# EAGLE design Haptic Schematic (EAGLE 7.7.0)
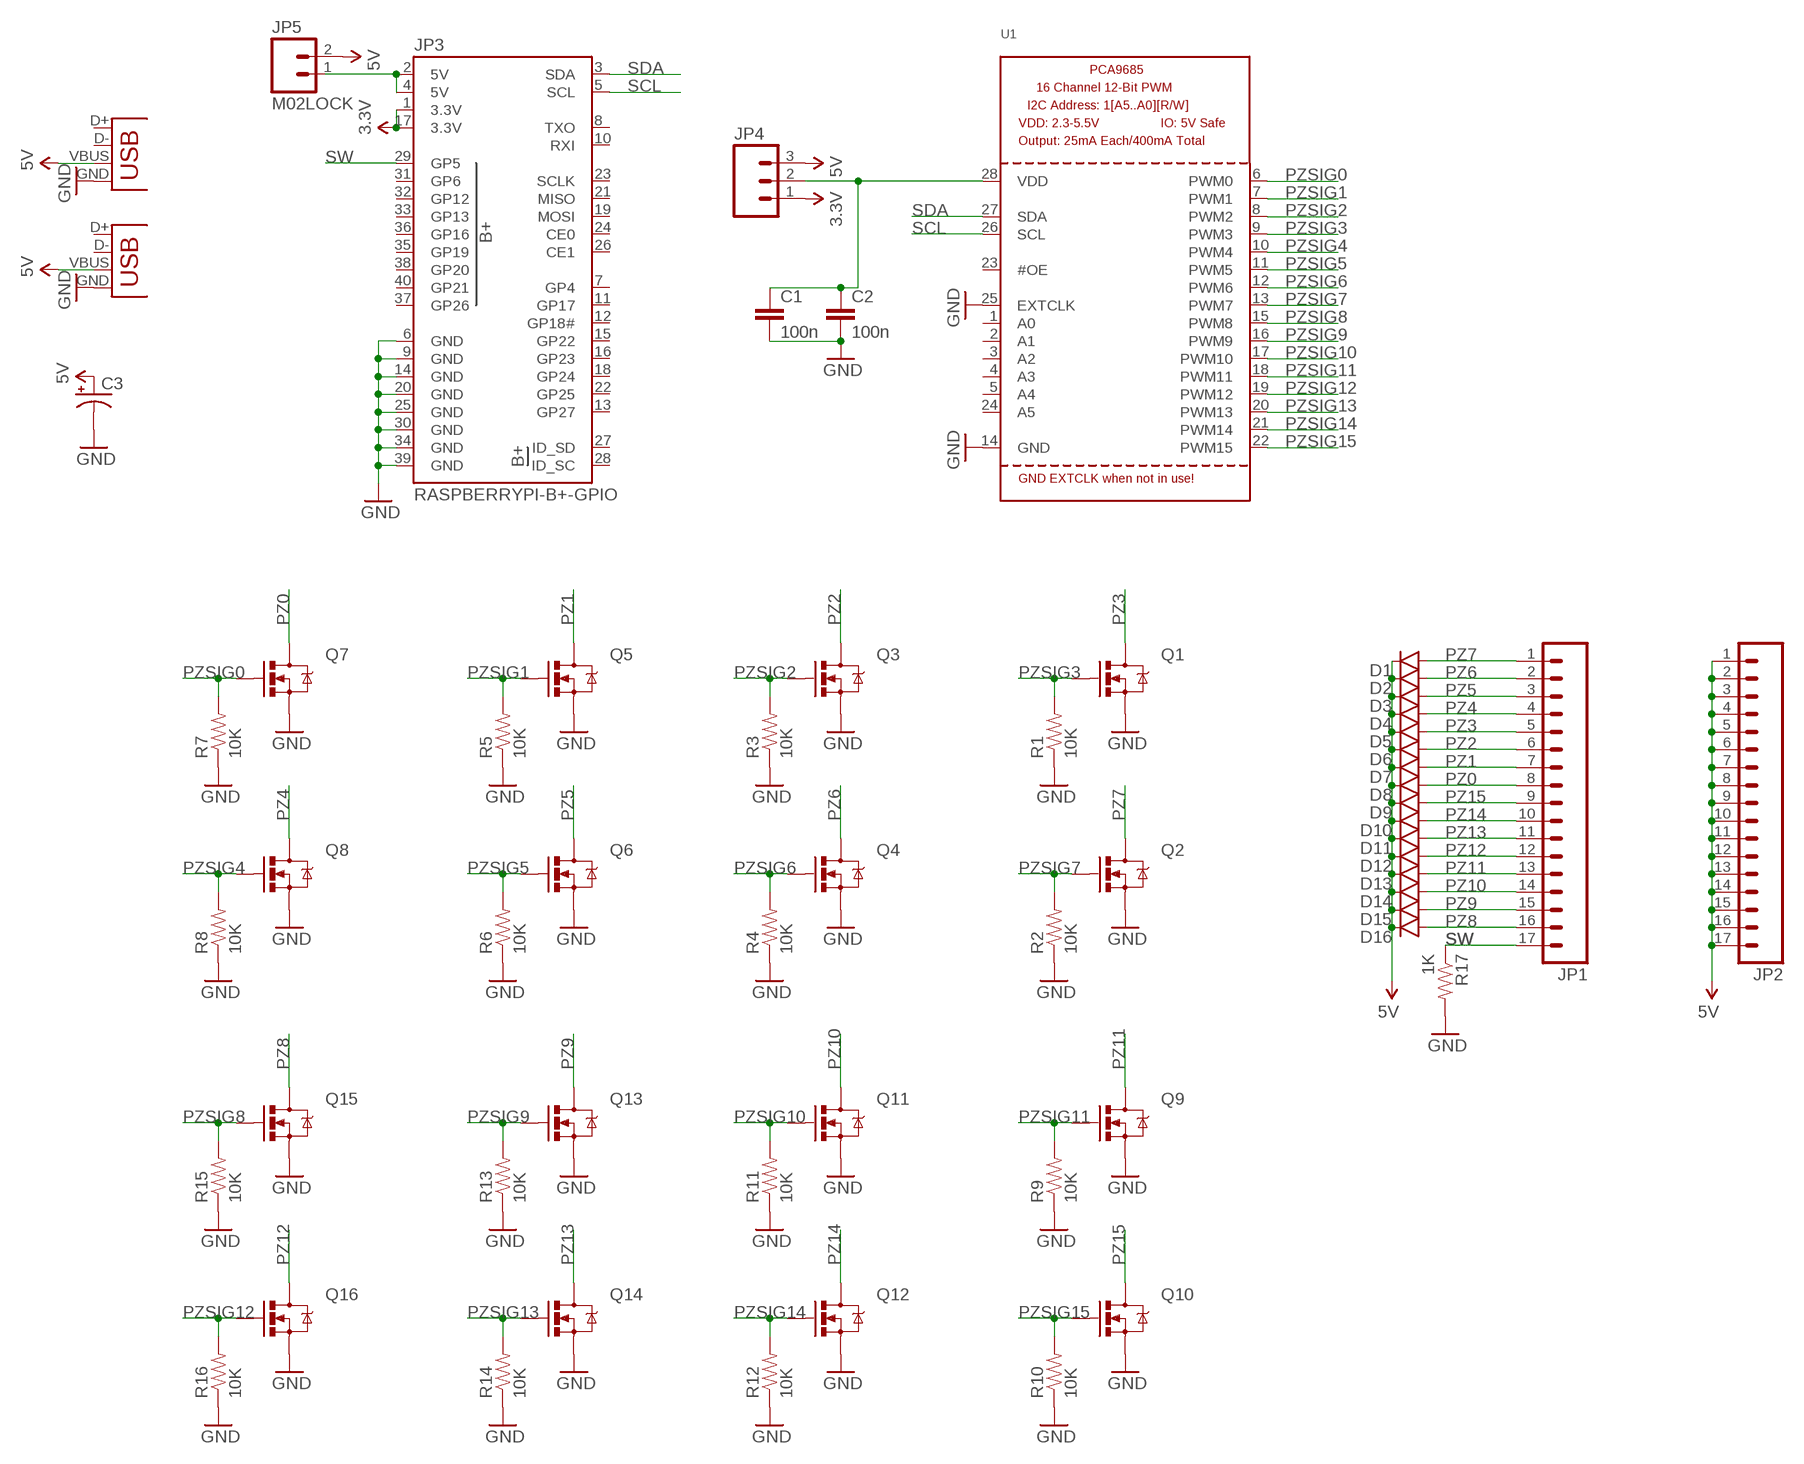
[diagram p0: schematic, sheet 1]

## Parts
C1  100n  CAP0805  [0805]
C2  100n  CAP0805  [0805]
C3  CAP_POLPTH2  [CPOL-RADIAL-10UF-25V]
D1  DIODESOD523  [SOD523]
D2  DIODESOD523  [SOD523]
D3  DIODESOD523  [SOD523]
D4  DIODESOD523  [SOD523]
D5  DIODESOD523  [SOD523]
D6  DIODESOD523  [SOD523]
D7  DIODESOD523  [SOD523]
D8  DIODESOD523  [SOD523]
D9  DIODESOD523  [SOD523]
D10  DIODESOD523  [SOD523]
D11  DIODESOD523  [SOD523]
D12  DIODESOD523  [SOD523]
D13  DIODESOD523  [SOD523]
D14  DIODESOD523  [SOD523]
D15  DIODESOD523  [SOD523]
D16  DIODESOD523  [SOD523]
JP1  M17  [1X17]
JP2  M17  [1X17]
JP3  RASPBERRYPI-B+-GPIO  [2X20-SHROUDED]
JP4  M03LOCK  [1X03_LOCK]
JP5  M02LOCK  [1X02_LOCK]
JP6  USB-B  USBPTH  [USB-B-PTH]
JP7  USB-B  USBPTH  [USB-B-PTH]
Q1  MOSFET-NCHANNEL2N7002PW  [SOT323]
Q2  MOSFET-NCHANNEL2N7002PW  [SOT323]
Q3  MOSFET-NCHANNEL2N7002PW  [SOT323]
Q4  MOSFET-NCHANNEL2N7002PW  [SOT323]
Q5  MOSFET-NCHANNEL2N7002PW  [SOT323]
Q6  MOSFET-NCHANNEL2N7002PW  [SOT323]
Q7  MOSFET-NCHANNEL2N7002PW  [SOT323]
Q8  MOSFET-NCHANNEL2N7002PW  [SOT323]
Q9  MOSFET-NCHANNEL2N7002PW  [SOT323]
Q10  MOSFET-NCHANNEL2N7002PW  [SOT323]
Q11  MOSFET-NCHANNEL2N7002PW  [SOT323]
Q12  MOSFET-NCHANNEL2N7002PW  [SOT323]
Q13  MOSFET-NCHANNEL2N7002PW  [SOT323]
Q14  MOSFET-NCHANNEL2N7002PW  [SOT323]
Q15  MOSFET-NCHANNEL2N7002PW  [SOT323]
Q16  MOSFET-NCHANNEL2N7002PW  [SOT323]
R1  10K  RESISTOR0805-RES  [0805]
R2  10K  RESISTOR0805-RES  [0805]
R3  10K  RESISTOR0805-RES  [0805]
R4  10K  RESISTOR0805-RES  [0805]
R5  10K  RESISTOR0805-RES  [0805]
R6  10K  RESISTOR0805-RES  [0805]
R7  10K  RESISTOR0805-RES  [0805]
R8  10K  RESISTOR0805-RES  [0805]
R9  10K  RESISTOR0805-RES  [0805]
R10  10K  RESISTOR0805-RES  [0805]
R11  10K  RESISTOR0805-RES  [0805]
R12  10K  RESISTOR0805-RES  [0805]
R13  10K  RESISTOR0805-RES  [0805]
R14  10K  RESISTOR0805-RES  [0805]
R15  10K  RESISTOR0805-RES  [0805]
R16  10K  RESISTOR0805-RES  [0805]
R17  1K  RESISTOR0805-RES  [0805]
U1  PCA9685  [TSSOP28]

## Nets
3.3V: JP3.1(3.3V) JP3.17(3.3V) JP4.1
5V: C3.1(+) D1.C D2.C D3.C D4.C D5.C D6.C D7.C D8.C D9.C D10.C D11.C D12.C D13.C D14.C D15.C D16.C JP2.1 JP2.2 JP2.3 JP2.4 JP2.5 JP2.6 JP2.7 JP2.8 JP2.9 JP2.10 JP2.11 JP2.12 JP2.13 JP2.14 JP2.15 JP2.16 JP2.17 JP4.3 JP5.2 JP6.VBUS JP7.VBUS
GND: C1.2 C2.2 C3.2(-) JP3.6(GND) JP3.9(GND) JP3.14(GND) JP3.20(GND) JP3.25(GND) JP3.30(GND) JP3.34(GND) JP3.39(GND) JP6.GND JP7.GND Q1.2(S) Q2.2(S) Q3.2(S) Q4.2(S) Q5.2(S) Q6.2(S) Q7.2(S) Q8.2(S) Q9.2(S) Q10.2(S) Q11.2(S) Q12.2(S) Q13.2(S) Q14.2(S) Q15.2(S) Q16.2(S) R1.1 R2.1 R3.1 R4.1 R5.1 R6.1 R7.1 R8.1 R9.1 R10.1 R11.1 R12.1 R13.1 R14.1 R15.1 R16.1 R17.2 U1.14(GND) U1.25(EXTCLK)
N$2: JP3.2(5V) JP3.4(5V) JP5.1
N$3: C1.1 C2.1 JP4.2 U1.28(VDD)
PZ0: D8.A JP1.8 Q7.3(D)
PZ1: D7.A JP1.7 Q5.3(D)
PZ2: D6.A JP1.6 Q3.3(D)
PZ3: D5.A JP1.5 Q1.3(D)
PZ4: D4.A JP1.4 Q8.3(D)
PZ5: D3.A JP1.3 Q6.3(D)
PZ6: D2.A JP1.2 Q4.3(D)
PZ7: D1.A JP1.1 Q2.3(D)
PZ8: D16.A JP1.16 Q15.3(D)
PZ9: D15.A JP1.15 Q13.3(D)
PZ10: D14.A JP1.14 Q11.3(D)
PZ11: D13.A JP1.13 Q9.3(D)
PZ12: D12.A JP1.12 Q16.3(D)
PZ13: D11.A JP1.11 Q14.3(D)
PZ14: D10.A JP1.10 Q12.3(D)
PZ15: D9.A JP1.9 Q10.3(D)
PZSIG0: Q7.1(G) R7.2 U1.6(PWM0)
PZSIG1: Q5.1(G) R5.2 U1.7(PWM1)
PZSIG2: Q3.1(G) R3.2 U1.8(PWM2)
PZSIG3: Q1.1(G) R1.2 U1.9(PWM3)
PZSIG4: Q8.1(G) R8.2 U1.10(PWM4)
PZSIG5: Q6.1(G) R6.2 U1.11(PWM5)
PZSIG6: Q4.1(G) R4.2 U1.12(PWM6)
PZSIG7: Q2.1(G) R2.2 U1.13(PWM7)
PZSIG8: Q15.1(G) R15.2 U1.15(PWM8)
PZSIG9: Q13.1(G) R13.2 U1.16(PWM9)
PZSIG10: Q11.1(G) R11.2 U1.17(PWM10)
PZSIG11: Q9.1(G) R9.2 U1.18(PWM11)
PZSIG12: Q16.1(G) R16.2 U1.19(PWM12)
PZSIG13: Q14.1(G) R14.2 U1.20(PWM13)
PZSIG14: Q12.1(G) R12.2 U1.21(PWM14)
PZSIG15: Q10.1(G) R10.2 U1.22(PWM15)
SCL: JP3.5(SCL) U1.26(SCL)
SDA: JP3.3(SDA) U1.27(SDA)
SW: JP1.17 JP3.29(GP5) R17.1
Unconnected: JP3.7(GP4) JP3.8(TXO) JP3.10(RXI) JP3.11(GP17) JP3.12(GP18#) JP3.13(GP27) JP3.15(GP22) JP3.16(GP23) JP3.18(GP24) JP3.19(MOSI) JP3.21(MISO) JP3.22(GP25) JP3.23(SCLK) JP3.24(CE0) JP3.26(CE1) JP3.27(ID_SD) JP3.28(ID_SC) JP3.31(GP6) JP3.32(GP12) JP3.33(GP13) JP3.35(GP19) JP3.36(GP16) JP3.37(GP26) JP3.38(GP20) JP3.40(GP21) JP6.D+ JP6.D- JP7.D+ JP7.D- U1.1(A0) U1.2(A1) U1.3(A2) U1.4(A3) U1.5(A4) U1.23(#OE) U1.24(A5)

## Library data of the parts
C1 C2 = SparkFun-Passives:CAP: Capacitor Standard 0603 ceramic capacitor, and 0.1" leaded capacitor.
C3 = SparkFun-Passives:CAP_POL: Capacitor Polarized These are standard SMD and PTH capacitors. Normally 10uF, 47uF, and 100uF in electrolytic and tantalum varieties. Always verify the external diameter of the through hole cap, it varies with capacity, voltage, and manufacturer. The EIA devices should be standard.
D1-D16 = SparkFun-DiscreteSemi:DIODE: Diode These are standard reverse protection diodes and small signal diodes. SMA package can handle up to about 1A. SOD-323 can handle about 200mA. What the SOD-323 package when ordering, there are some mfgs out there that are 5-pin packages.
JP1 JP2 = SparkFun-Connectors:M17: 1x17 .1" header
JP3 = SparkFun-Boards:RASPBERRYPI-B+-GPIO: Raspberry Pi B+ GPIO Header 2x20 pin connector
JP4 = SparkFun-Connectors:M03: Header 3 Standard 3-pin 0.1" header. Use with straight break away headers (SKU : PRT-00116), right angle break away headers (PRT-00553), swiss pins (PRT-00743), machine pins (PRT-00117), and female headers (PRT-00115). Molex polarized connector foot print use with SKU : PRT-08232 with associated crimp pins and housings.
JP5 = SparkFun-Connectors:M02: Standard 2-pin 0.1" header. Use with - straight break away headers ( PRT-00116) - right angle break away headers (PRT-00553) - swiss pins (PRT-00743) - machine pins (PRT-00117) - female headers (PRT-00115) Molex polarized connector foot print use with: PRT-08233 with associated crimp pins and housings. 2.54_SCREWTERM for use with PRT-10571. 3.5mm Screw Terminal footprints for PRT-08084 5mm Screw Terminal footprints for use with PRT-08433
JP6 JP7 = SparkFun-Connectors:USB: USB Connectors USB-B-PTH is fully proven SKU : PRT-00139/CONN-08278 USB-miniB is fully proven SKU : PRT-00587 USB-A-PCB is untested. USB-A-H is throughly reviewed, but untested. Spark Fun Electronics SKU : PRT-00437 USB-B-SMT is throughly reviewed, but untested. Needs silkscreen touching up. USB-A-S has not been used/tested USB-MB-H has not been used/tested USB-MICROB has been used. CONN-09505; PROD_ID: CONN-08278
Q1-Q16 = SparkFun-DiscreteSemi:MOSFET-NCHANNEL: Common NMOSFET Parts MFG P/N Store ID Prod ID FDD8780 TRANS-09984 SI7820DN TRANS-11055 FDS6630A IC-08089 2N7002PW TRANS-11151 FQP30N06L COM-10213 TRANS-10060 BSS123LT1G TRANS-08345 BSS138 TRANS-00830 BS170 2N7000; PROD_ID: TRANS-11151
R1-R17 = SparkFun-Resistors:RESISTOR: Resistor Basic schematic elements and footprints for 0603, 1206, and PTH resistors.
U1 = adafruit:PCA9685: PCA9685 - 16 Channel 12-Bit I2C PWM Controller 5.0V tolerant 16 channel, 12-bit I2C PWM controller with 25mA per output (max. 400mA total) Digikey: 568-5931-1-ND

## Board
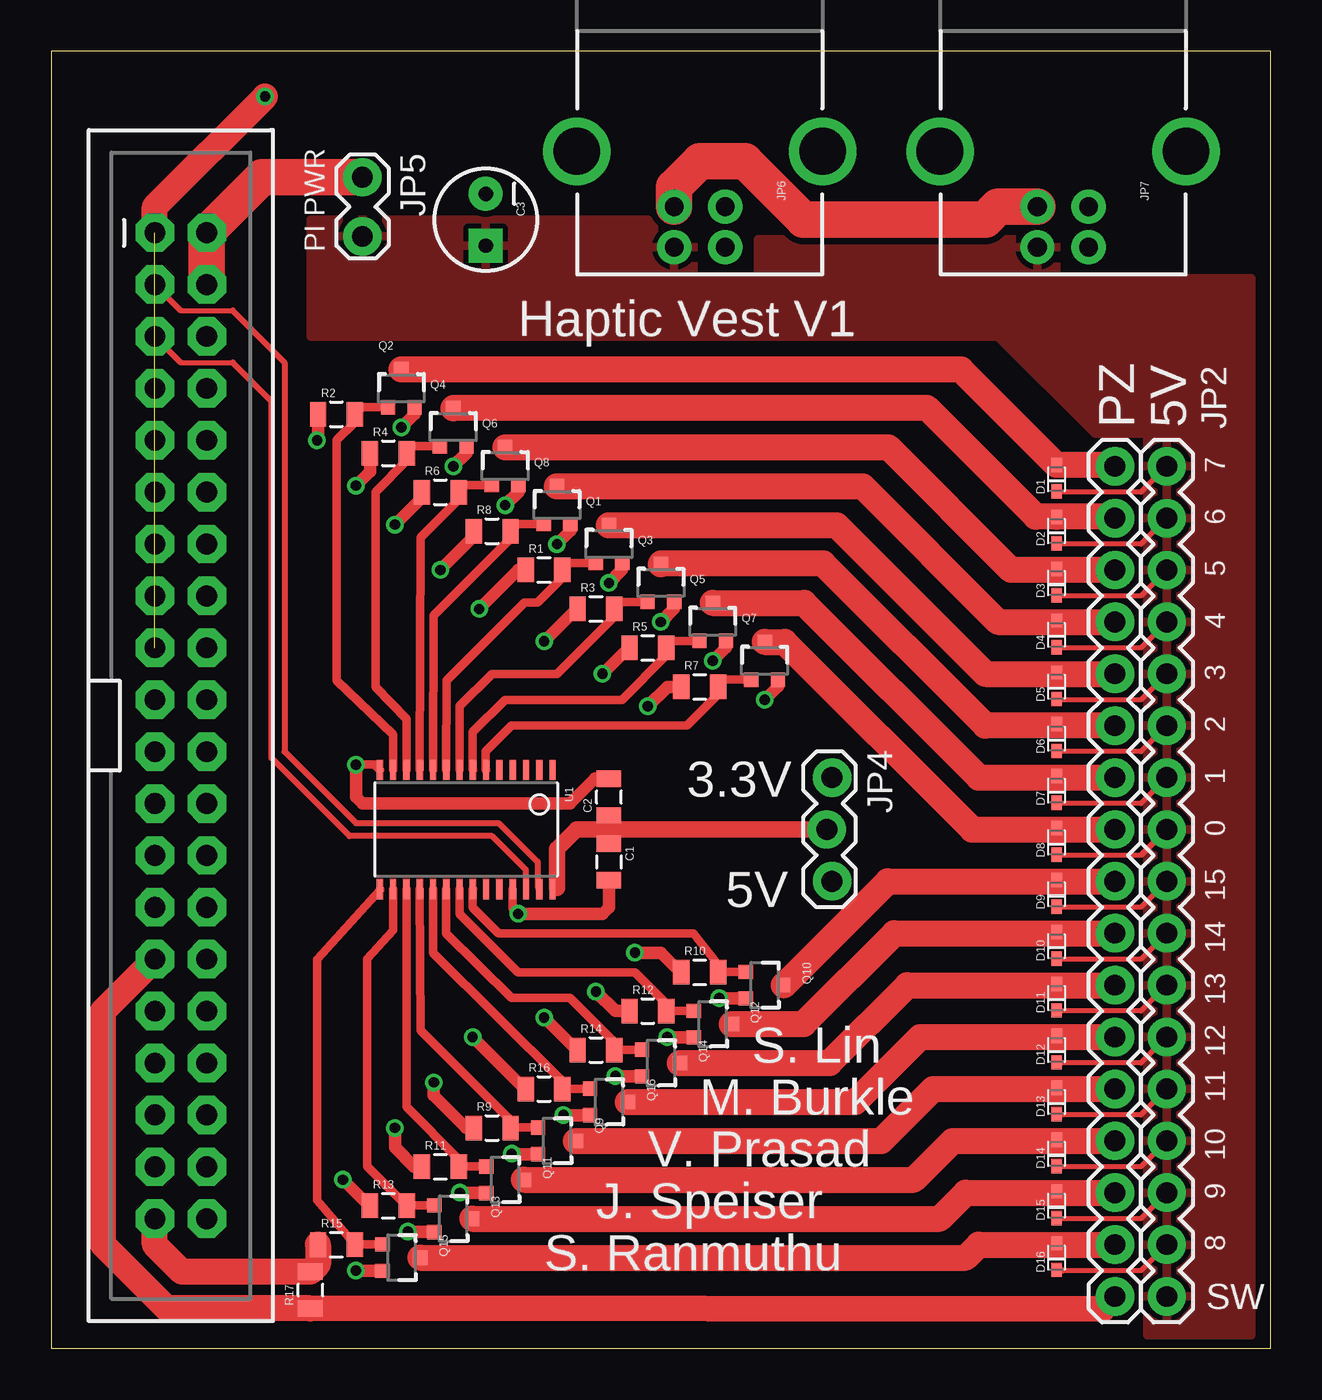
[diagram p1: board, top side]
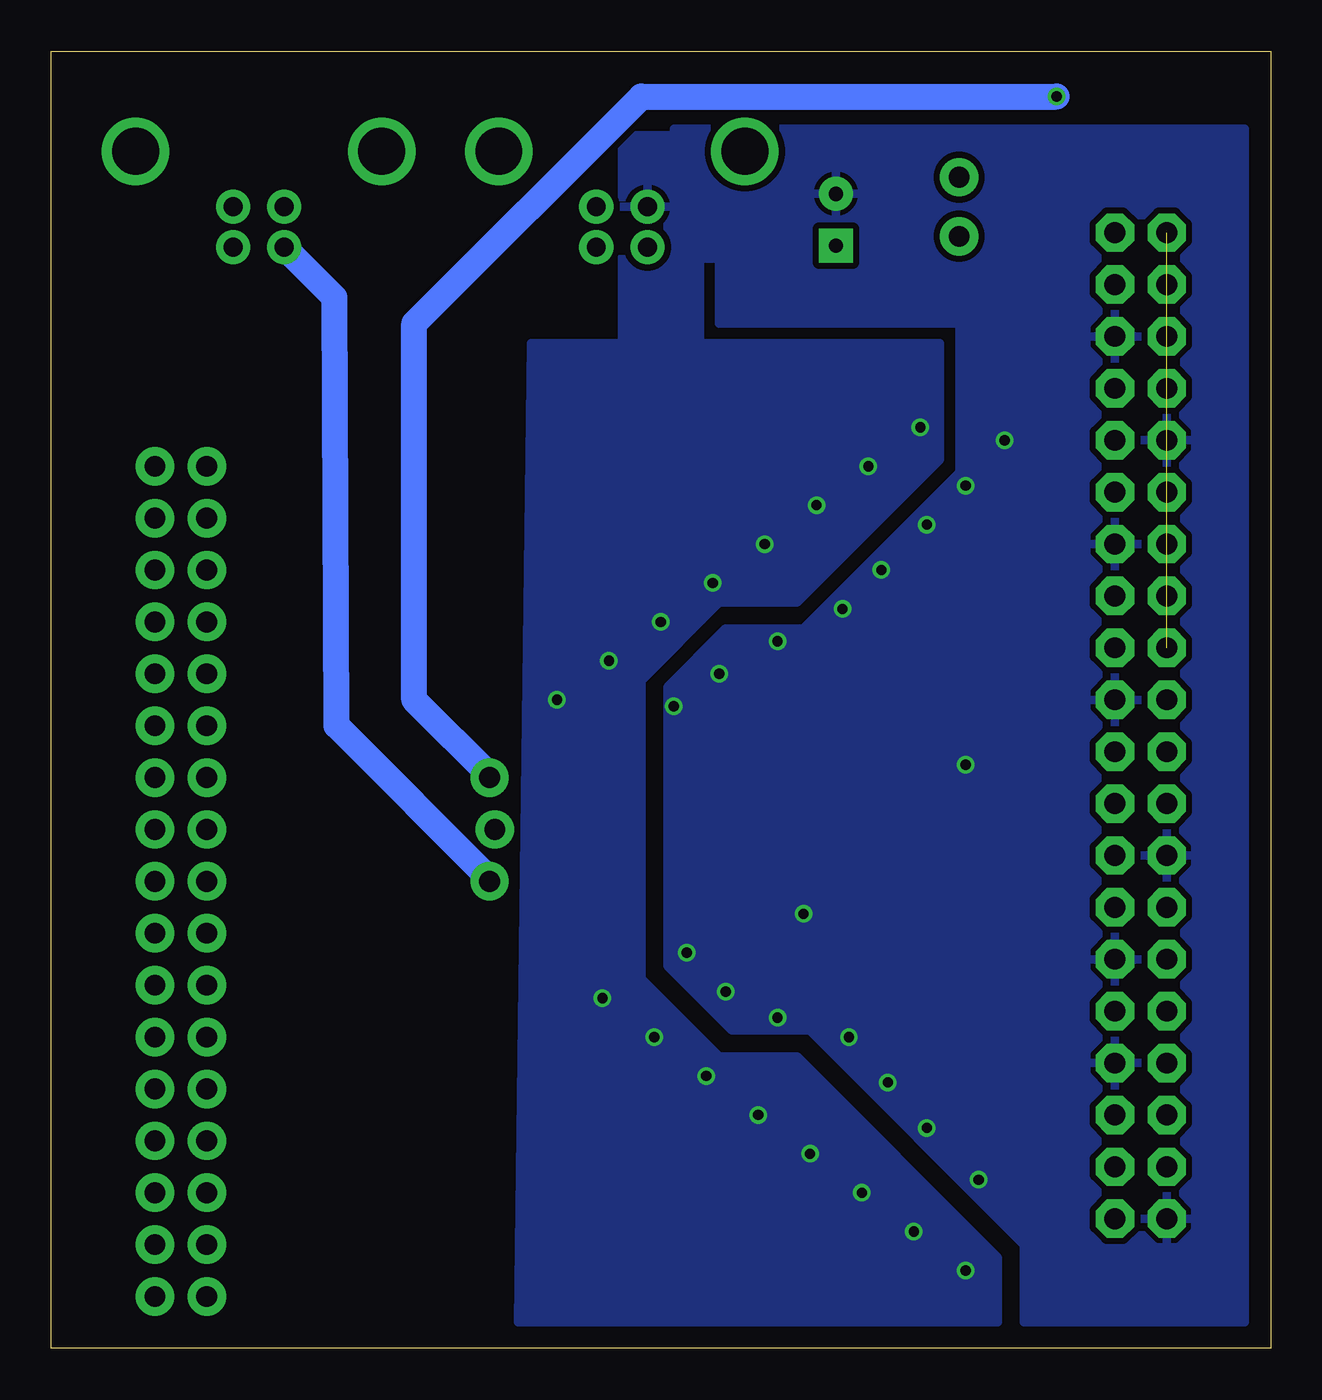
[diagram p2: board, bottom side, seen from below]

Size 59.69 x 63.5 mm. Coordinates in mm from the lower left corner, seen from the top.
Outline: 0,0 59.69,0 59.69,63.5 0,63.5 0,0
Copper layers (1*16): Top 0.0356mm / dielectric 1.5011mm / Bottom 0.0356mm
Design rules "LaenPCBOrder *": minimum track width 6mil, minimum drill 13mil, track to track 6mil, track to pad 6mil, pad to pad 6mil, via to via 6mil, smd to smd 6mil, copper to edge 15mil, drill to drill 6mil, minimum pad ring 7mil, minimum via ring 7mil, stop-mask expansion 3mil, vias tented up to drill 20mil, thermal gap 10mil

### Footprints (pad centres in the part's own frame; a part is rotated, then mirrored left to right if it is on the bottom)
0805 = smd 0.8 x 1.2: 1 -0.9,0; 2 0.9,0
CPOL-RADIAL-10UF-25V = drill 0.7 pad 1.651 square: 1 1.27,0 | drill 0.7 pad 1.651: 2 -1.27,0
SOD523 = smd 0.7 x 0.5: A 0.7,0; C -0.6,0
1X17 = drill 1.016 pad 1.88: 1 0,0; 2 2.54,0; 3 5.08,0; 4 7.62,0; 5 10.16,0; 6 12.7,0; 7 15.24,0; 8 17.78,0; 9 20.32,0; 10 22.86,0; 11 25.4,0; 12 27.94,0; 13 30.48,0; 14 33.02,0; 15 35.56,0; 16 38.1,0; 17 40.64,0
2X20-SHROUDED = drill 1.016 pad 1.88 octagon: 1 -1.27,24.13; 2 1.27,24.13; 3 -1.27,21.59; 4 1.27,21.59; 5 -1.27,19.05; 6 1.27,19.05; 7 -1.27,16.51; 8 1.27,16.51; 9 -1.27,13.97; 10 1.27,13.97; 11 -1.27,11.43; 12 1.27,11.43; 13 -1.27,8.89; 14 1.27,8.89; 15 -1.27,6.35; 16 1.27,6.35; 17 -1.27,3.81; 18 1.27,3.81; 19 -1.27,1.27; 20 1.27,1.27; 21 -1.27,-1.27; 22 1.27,-1.27; 23 -1.27,-3.81; 24 1.27,-3.81; 25 -1.27,-6.35; 26 1.27,-6.35; 27 -1.27,-8.89; 28 1.27,-8.89; 29 -1.27,-11.43; 30 1.27,-11.43; 31 -1.27,-13.97; 32 1.27,-13.97; 33 -1.27,-16.51; 34 1.27,-16.51; 35 -1.27,-19.05; 36 1.27,-19.05; 37 -1.27,-21.59; 38 1.27,-21.59; 39 -1.27,-24.13; 40 1.27,-24.13
1X03_LOCK = drill 1.016 pad 1.88: 1 0,0.127; 2 2.54,-0.127; 3 5.08,0.127
1X02_LOCK = drill 1.016 pad 1.88: 1 -0.178,0; 2 2.718,0
USB-B-PTH = drill 0.914 pad 1.676: D+ 0,1.25; D- 1.981,1.25; GND 0,-1.25; VBUS 1.981,-1.25 | drill 2.286: S1 -2.718,-6.02; S2 -2.718,6.02
SOT323 = smd 0.7 x 0.7: 1 -0.65,-0.925; 2 0.65,-0.925; 3 0,0.925
TSSOP28 = smd 0.305 x 0.991: 1 -4.225,-2.918; 2 -3.575,-2.918; 3 -2.925,-2.918; 4 -2.275,-2.918; 5 -1.625,-2.918; 6 -0.975,-2.918; 7 -0.325,-2.918; 8 0.325,-2.918; 9 0.975,-2.918; 10 1.625,-2.918; 11 2.275,-2.918; 12 2.925,-2.918; 13 3.575,-2.918; 14 4.225,-2.918; 15 4.225,2.918; 16 3.575,2.918; 17 2.925,2.918; 18 2.275,2.918; 19 1.625,2.918; 20 0.975,2.918; 21 0.325,2.918; 22 -0.325,2.918; 23 -0.975,2.918; 24 -1.625,2.918; 25 -2.275,2.918; 26 -2.925,2.918; 27 -3.575,2.918; 28 -4.225,2.918

### Placement (x,y rotation side)
C1  27.3,23.81 270 top
C2  27.3,26.99 90 top
C3  21.27,55.24 270 top
D1  49.21,42.55 90 top
D2  49.21,40.01 90 top
D3  49.21,37.47 90 top
D4  49.21,34.92 90 top
D5  49.21,32.38 90 top
D6  49.21,29.84 90 top
D7  49.21,27.3 90 top
D8  49.21,24.77 90 top
D9  49.21,22.23 90 top
D10  49.21,19.68 90 top
D11  49.21,17.14 90 top
D12  49.21,14.61 90 top
D13  49.21,12.06 90 top
D14  49.21,9.53 90 top
D15  49.21,6.99 90 top
D16  49.21,4.45 90 top
JP1  52.07,43.18 270 top
JP2  54.61,43.18 270 top
JP3  6.35,30.48 0 top
JP4  38.1,27.94 270 top
JP5  15.24,57.15 270 top
JP6  31.75,55.88 270 top
JP7  49.53,55.88 270 top
Q1  27.3,39.37 0 top
Q2  17.14,46.99 0 top
Q3  29.84,37.47 0 top
Q4  19.68,45.09 0 top
Q5  32.38,35.56 0 top
Q6  22.23,43.18 0 top
Q7  34.92,33.66 0 top
Q8  24.77,41.27 0 top
Q9  24.77,10.16 270 top
Q10  34.92,17.78 270 top
Q11  22.23,8.26 270 top
Q12  32.38,15.88 270 top
Q13  19.68,6.35 270 top
Q14  29.84,13.97 270 top
Q15  17.14,4.45 270 top
Q16  27.3,12.06 270 top
R1  24.13,38.1 0 top
R2  13.97,45.72 0 top
R3  26.67,36.2 0 top
R4  16.51,43.81 0 top
R5  29.21,34.29 0 top
R6  19.05,41.91 0 top
R7  31.75,32.38 0 top
R8  21.59,40.01 0 top
R9  21.59,10.79 0 top
R10  31.75,18.41 0 top
R11  19.05,8.89 0 top
R12  29.21,16.51 0 top
R13  16.51,6.99 0 top
R14  26.67,14.61 0 top
R15  13.97,5.08 0 top
R16  24.13,12.7 0 top
R17  12.7,2.86 90 top
U1  20.32,25.4 180 top

### Tracks (layer width: path | path; a pad name or v marks a point on that pad's centre or on a via)
3.3V  (via drill 0.5)  (1 unrouted)
  Top 1.27: JP3.1 5.08,55.88 v10.48,61.28
  Bottom 1.27: JP4.1 38.1,27.94 41.91,31.75 41.91,50.16 30.8,61.28 v10.48,61.28
5V
  Top 0.254: JP2.1 53.34,41.91 49.25,41.91 D1.C | JP2.2 53.34,39.37 49.25,39.37 D2.C | JP2.3 53.34,36.83 49.25,36.83 D3.C | JP2.4 53.34,34.29 49.25,34.29 D4.C | JP2.5 53.34,31.75 49.25,31.75 D5.C | JP2.6 53.34,29.21 49.25,29.21 D6.C | JP2.7 53.34,26.67 49.25,26.67 D7.C | JP2.8 53.34,24.13 49.25,24.13 D8.C | JP2.9 53.34,21.59 49.25,21.59 D9.C | JP2.10 53.34,19.05 49.25,19.05 D10.C | JP2.11 53.34,16.51 49.25,16.51 D11.C | JP2.12 53.34,13.97 49.25,13.97 D12.C | JP2.13 53.34,11.43 49.25,11.43 D13.C | JP2.14 53.34,8.89 49.25,8.89 D14.C | JP2.15 53.34,6.35 49.25,6.35 D15.C | JP2.16 53.34,3.81 49.25,3.81 D16.C
  Top 0.305: 53.38,24.16 JP2.8 | D16.C 49.49,3.85 49.53,3.81
  Bottom 1.27: JP4.3 38.1,22.86 45.72,30.48 45.82,51.44 JP7.VBUS
  pour Top (isolate 0.305): 12.7,55.24 12.7,49.53 46.35,49.53 51.12,44.77 53.66,44.77 53.66,0.64 58.74,0.64 58.74,52.39 49.21,52.39 49.21,54.29 34.61,54.29 34.61,52.39 31.43,52.39 31.43,54.29 29.53,54.29 29.53,54.93 29.21,55.24
GND  (via drill 0.5, 0.5 pad 0.3)
  Top 0.406: v14.92,28.57 15.84,28.57 U1.14 | U1.25 22.59,21.54 v22.86,21.27
  Top 0.61: Q13.2 17.48,5.7 v17.46,5.71 | Q15.2 14.94,3.79 v14.92,3.81 | Q11.2 20.02,7.61 v20,7.62 | Q9.2 22.56,9.51 v22.54,9.53 | Q16.2 25.1,11.41 v25.08,11.43 | Q14.2 27.64,13.32 v27.62,13.34 | Q12.2 30.18,15.22 v30.16,15.24 | Q10.2 32.72,17.13 v32.7,17.14 | v34.92,31.75 35.58,32.4 Q7.2 | v32.38,33.66 33.03,34.3 Q5.2 | v29.84,35.56 30.5,36.21 Q3.2 | v27.3,37.47 27.95,38.12 Q1.2 | v24.77,39.37 25.41,40.02 Q8.2 | v22.23,41.27 22.88,41.92 Q6.2 | v19.68,43.18 20.34,43.83 Q4.2 | R2.1 13.07,44.5 v13.02,44.45 | Q2.2 17.8,45.73 v17.14,45.09 | C2.2 26.62,27.89 25.4,26.67 15.24,26.67 14.92,26.99 v14.92,28.57 | C1.2 27.3,21.59 26.99,21.27 v22.86,21.27 | R4.1 15.61,42.91 v14.92,42.23 | R6.1 18.15,41.65 v16.83,40.32 | R8.1 20.69,39.74 v19.05,38.1 | R1.1 22.86,38.1 v20.95,36.2 | R3.1 25.72,36.2 v24.13,34.61 | R5.1 28.26,34.29 v26.99,33.02 | R7.1 30.16,32.38 v29.21,31.43 | 20.64,10.79 R9.1 20.32,10.79 18.73,12.38 v18.73,13.02 | R13.1 15.56,6.99 v14.29,8.26 | R11.1 17.78,8.89 16.83,9.84 v16.83,10.79 | R16.1 23.18,12.7 v20.64,15.24 | R14.1 25.72,14.61 v24.13,16.19 | R12.1 27.62,16.51 v26.67,17.46 | R10.1 30.8,18.41 29.84,19.37 v28.57,19.37
  Top 1.27: JP3.39 5.08,5.08 6.4,3.76 R17.2 13.07,4.13 R15.1
  Top 1.778: JP6.GND 30.48,55.9 30.48,56.83 31.75,58.1 33.97,58.1 36.83,55.24 45.72,55.24 46.35,55.88 JP7.GND
  pour Bottom (isolate 0.305): 31.75,49.21 31.75,59.37 27.94,59.37 27.94,49.21 16.19,49.21 16.19,43.5 23.18,36.51 26.99,36.51 30.8,32.7 30.8,18.1 26.99,14.29 23.18,14.29 13.34,4.45 13.34,1.27 36.83,1.27 36.2,49.21
  pour Bottom (isolate 0.305): 26.99,50.16 15.24,50.16 15.24,42.86 22.86,35.24 26.67,35.24 29.53,32.38 29.53,18.73 26.35,15.56 22.54,15.56 12.06,5.08 12.06,1.27 1.27,1.27 1.27,59.69 29.21,59.69 29.21,53.34 26.99,53.34
N$2
  Top 1.778: JP5.1 10.34,57.33 JP3.2 JP3.4
N$3
  Top 0.254: C2.1 27.3,25.4 C1.1 | 24.77,22.54 24.61,22.54 U1.28
  Top 0.813: JP4.2 27.3,25.4 25.72,25.4 24.77,24.45 24.77,22.54
PZ0
  Top 0.254: D8.A 52.01,25.46 JP1.8
  Top 1.27: Q7.3 35.91,34.58 45.09,25.4 JP1.8
PZ1
  Top 0.305: D7.A 52.01,28 JP1.7
  Top 1.27: Q5.3 36.86,36.48 45.4,27.94 JP1.7
PZ2
  Top 0.305: D6.A 52.01,30.55 JP1.6
  Top 1.27: JP1.6 45.72,30.48 37.78,38.42 29.87,38.42 Q3.3
PZ3
  Top 0.305: D5.A 52.01,33.09 JP1.5
  Top 1.27: Q1.3 38.45,40.3 45.72,33.02 JP1.5
PZ4
  Top 0.305: D4.A 52.01,35.62 JP1.4
  Top 1.27: Q8.3 39.72,42.2 46.35,35.56 JP1.4
PZ5
  Top 0.305: D3.A 52.01,38.16 JP1.3
  Top 1.27: Q6.3 40.98,44.1 46.99,38.1 JP1.3
PZ6
  Top 1.27: JP1.2 52.01,40.7 D2.A 48.2,40.7 42.86,46.04 19.71,46.04 Q4.3
PZ7
  Top 1.27: JP1.1 52.01,43.24 D1.A 44.54,47.91 Q2.3
PZ8
  Top 0.305: D16.A 52.01,5.14 JP1.16
  Top 1.27: Q15.3 44.77,4.45 45.4,5.08 JP1.16
PZ9
  Top 0.305: D15.A 52.01,7.68 JP1.15
  Top 1.27: Q13.3 43.5,6.35 44.77,7.62 JP1.15
PZ10
  Top 0.305: D14.A 52.01,10.22 JP1.14
  Top 1.27: Q11.3 42.23,8.26 44.13,10.16 JP1.14
PZ11
  Top 0.305: D13.A 52.01,12.77 JP1.13
  Top 1.27: Q9.3 40.64,10.16 43.18,12.7 JP1.13
PZ12
  Top 0.305: D12.A 52.01,15.3 JP1.12
  Top 1.27: Q16.3 39.37,12.06 42.55,15.24 JP1.12
PZ13
  Top 0.305: D11.A 52.01,17.84 JP1.11
  Top 1.27: Q14.3 38.1,13.97 41.91,17.78 JP1.11
PZ14
  Top 0.254: D10.A 52.01,20.39 JP1.10
  Top 1.27: Q12.3 36.83,15.88 41.27,20.32 JP1.10
PZ15
  Top 0.254: D9.A 52.01,22.93 JP1.9
  Top 1.27: Q10.3 35.88,17.78 40.96,22.86 JP1.9
PZSIG0
  Top 0.406: U1.6 21.27,28.34 21.27,29.21 22.54,30.48 31.11,30.48 32.65,32.02 R7.2 32.99,32.73 Q7.1
PZSIG1
  Top 0.406: U1.7 20.64,30.16 22.23,31.75 27.94,31.75 30.11,33.92 R5.2 30.45,34.63 Q5.1
PZSIG2
  Top 0.406: U1.8 20,31.43 21.59,33.02 24.77,33.02 27.57,35.83 R3.2 27.91,36.54 Q3.1
PZSIG3
  Top 0.406: U1.9 19.34,28.37 19.37,32.7 23.18,36.51 23.81,36.51 25.03,37.73 R1.2 25.38,38.45 Q1.1
PZSIG4
  Top 0.406: U1.10 18.71,28.36 18.73,35.88 22.49,39.63 R8.2 22.84,40.35 Q8.1
PZSIG5
  Top 0.406: U1.11 18.05,28.37 18.1,39.69 19.95,41.54 R6.2 20.3,42.26 Q6.1
PZSIG6
  Top 0.406: U1.12 17.41,28.39 17.41,30.8 15.88,32.38 15.88,41.91 17.41,43.45 R4.2 17.75,44.16 Q4.1
PZSIG7
  Top 0.406: U1.13 16.75,28.6 16.75,30.05 13.97,32.7 13.97,44.45 14.87,45.35 R2.2 15.21,46.06 Q2.1
PZSIG8
  Top 0.406: U1.15 16.09,22.45 13.02,19.05 13.02,7.25 R15.2 14.88,5.09 Q15.1
PZSIG9
  Top 0.406: U1.16 16.74,20.46 15.47,19.06 15.47,8.92 R13.2 17.43,7 Q13.1
PZSIG10
  Top 0.406: U1.17 17.39,11.81 19.95,9.26 R11.2 19.96,8.9 Q11.1
PZSIG11
  Top 0.406: U1.18 18.05,22.43 18.1,15.56 22.49,11.16 R9.2 22.5,10.81 Q9.1
PZSIG12
  Top 0.406: U1.19 18.71,22.45 18.71,19.37 25.03,13.07 R16.2 25.05,12.71 Q16.1
PZSIG13
  Top 0.406: U1.20 19.34,22.46 19.34,20.32 22.54,17.14 25.4,17.14 27.57,14.97 R14.2 27.59,14.62 Q14.1
PZSIG14
  Top 0.406: U1.21 20,21.27 22.86,18.41 28.57,18.41 30.11,16.88 R12.2 30.12,16.52 Q12.1
PZSIG15
  Top 0.406: U1.22 20.64,21.59 21.91,20.32 31.43,20.32 32.65,18.79 R10.2 32.66,18.43 Q10.1
SCL
  Top 0.254: 6.35,48.26 8.89,48.26
  Top 0.305: U1.26 23.25,23.43 21.59,25.08 14.61,25.08 10.79,28.89 10.79,46.35 8.89,48.26 | JP3.5 6.35,48.26
SDA
  Top 0.254: 6.35,50.8 8.89,50.8
  Top 0.305: JP3.3 6.35,50.8 | 8.89,50.8 11.43,48.26 11.43,29.21 14.92,25.72 21.91,25.72 23.81,23.81 23.81,22.57 U1.27
SW
  Top 1.27: JP1.17 51.44,1.91 R17.1 5.66,1.96 2.54,5.08 2.54,16.51 JP3.29

### Text on the board
tNames: PI PWR | Haptic Vest V1 | PZ | 5V | 7 | 6 | 5 | 4 | 3 | 2 | 1 | 3.3V | 0 | 5V | 15 | 14 | 13 | S. Lin | 12 | 11 | M. Burkle | V. Prasad | 10 | 9 | J. Speiser | 8 | S. Ranmuthu | SW